# Altium schematic sheet MCU and Peripherals.SchDoc
size 431 x 279 mm; SheetNumber: 1; SheetTotal: 2
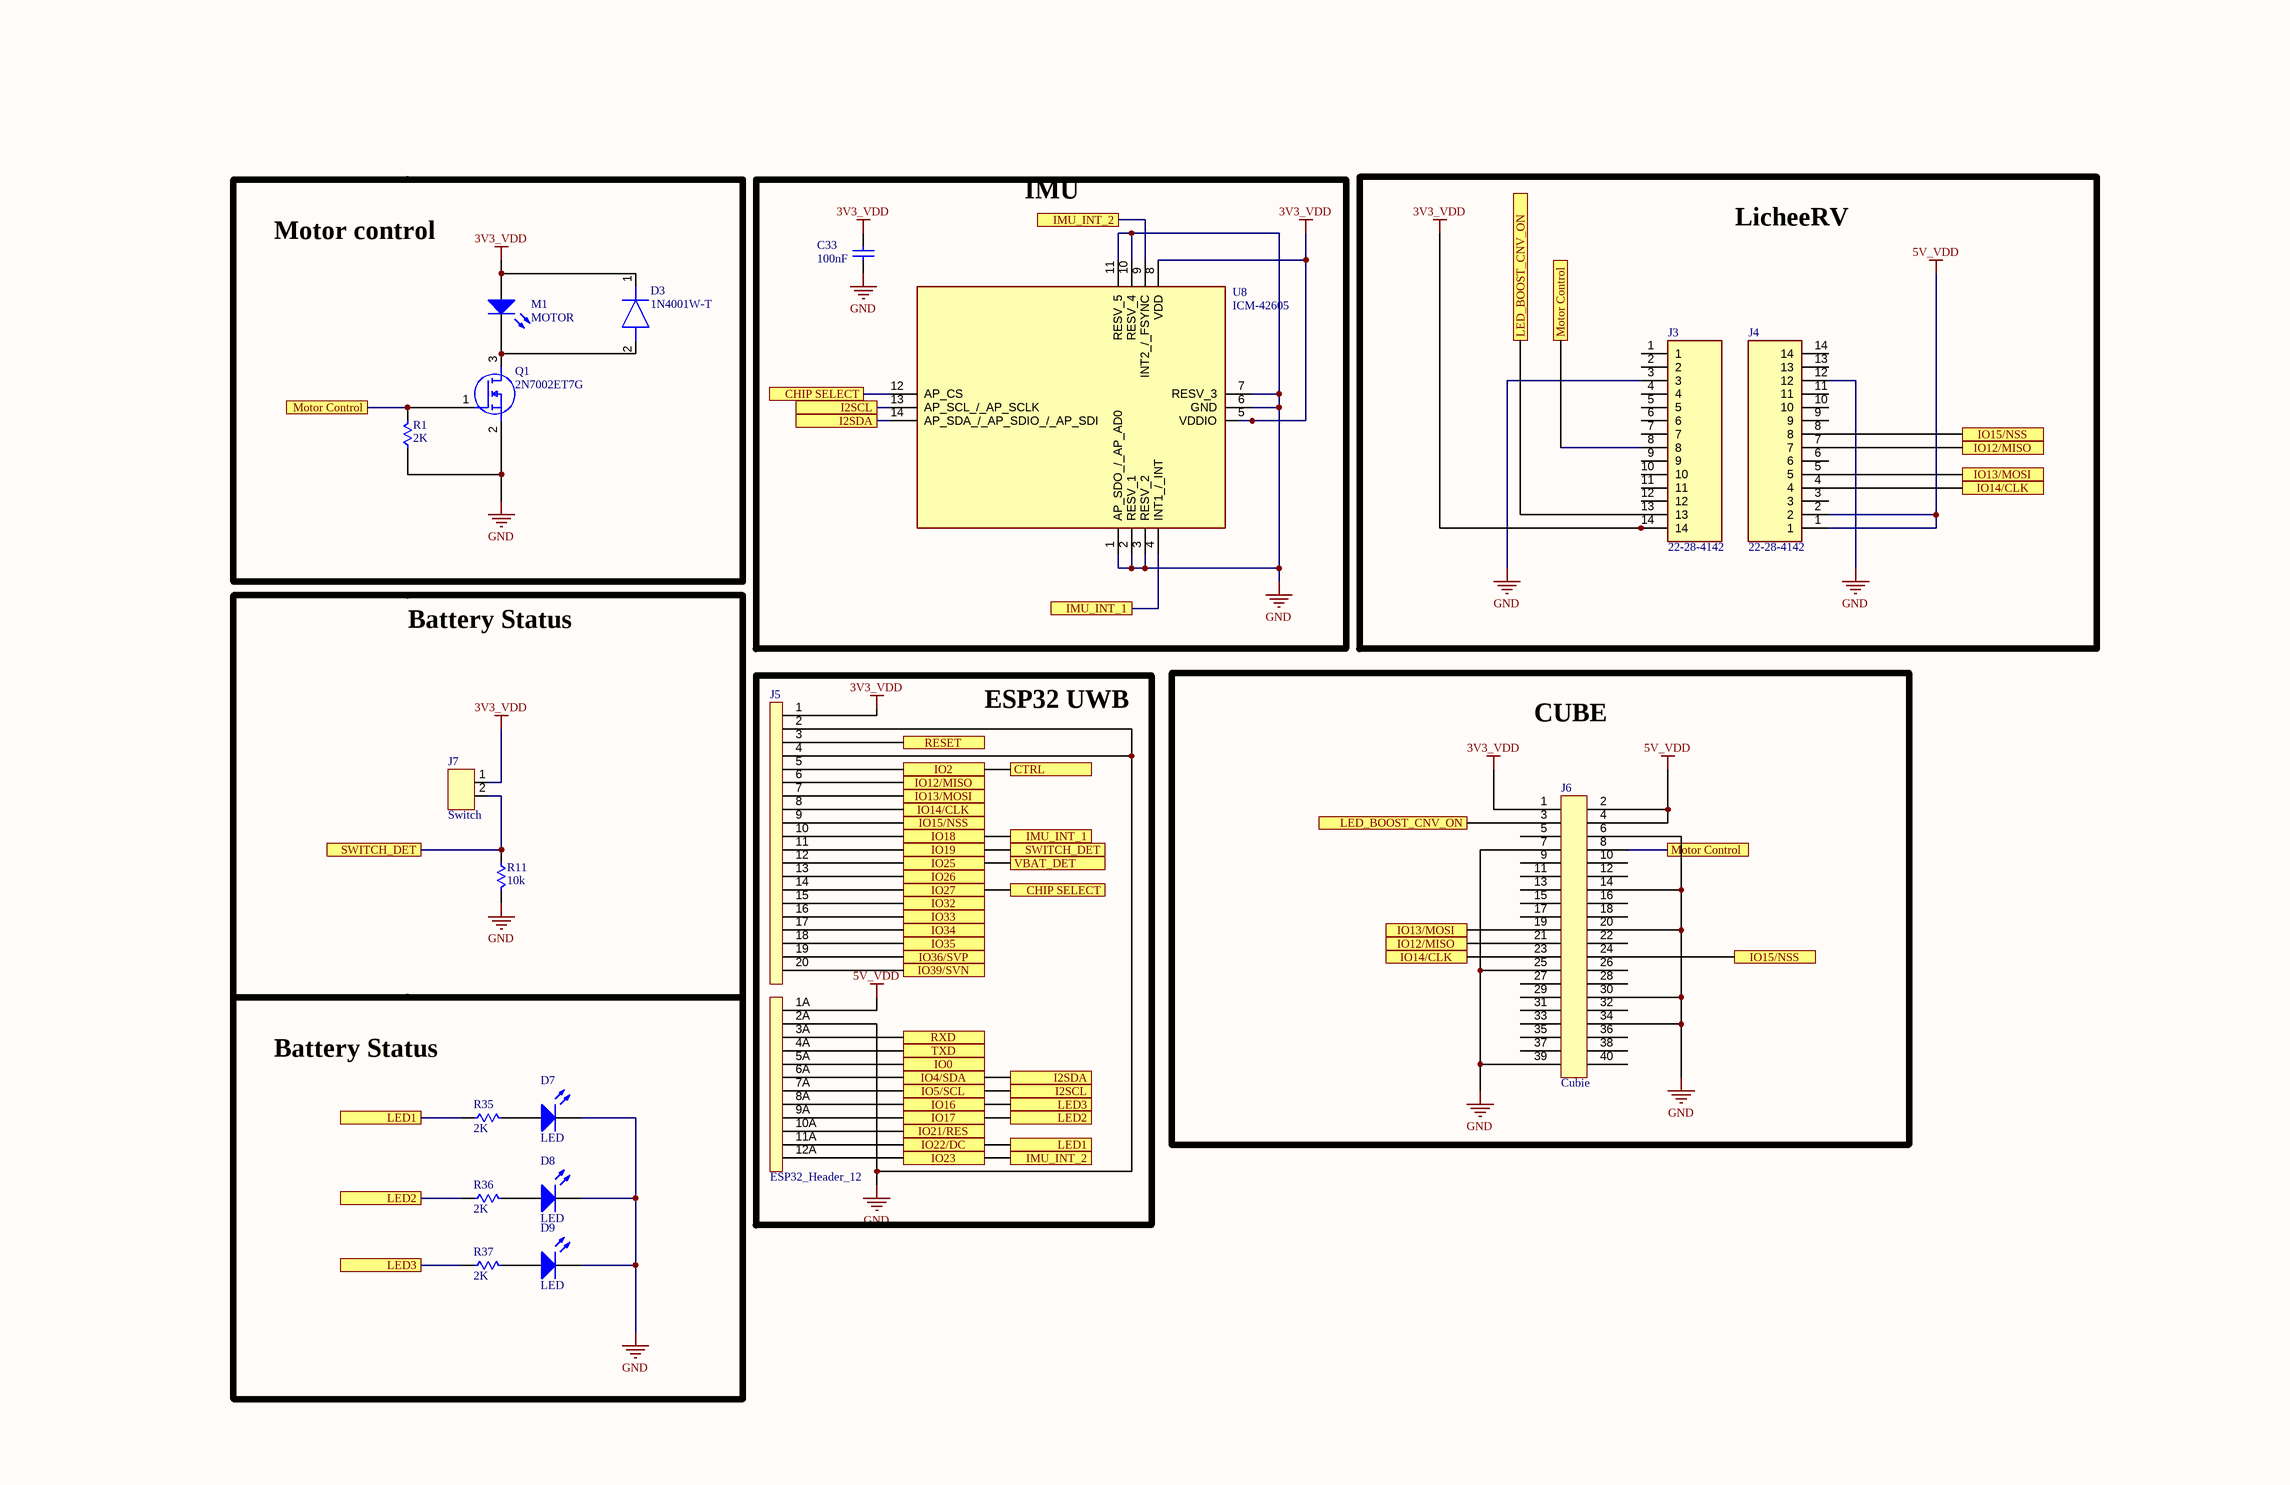
[diagram p0: MCU and Peripherals.SchDoc]

## Parts
C33  Capacitance: 100nF  [0603C]  (hidden comment: Capacitor)
D3  1N4001W-T  [SODFL3818X130N]
D7  LED  [SolderWires]
D8  LED  [SolderWires]
D9  LED  [SolderWires]
J3  22-28-4142  [HDRV14W63P0X254_1X14_3556X250X950P]
J4  22-28-4142  [HDRV14W63P0X254_1X14_3556X250X950P]
J5  ESP32_Header_12  [12P-2.54]
J6  Cubie  [40Pin]
J7  Switch  [SWITCH SOLDER]
M1  MOTOR  [SolderWires]
Q1  2N7002ET7G  [SOT96P237X111-3N]
R1  2K  [R0603]
R11  10k  [R0603]
R35  2K  [R0603]
R36  2K  [R0603]
R37  2K  [R0603]
U8  ICM-42605  [IIM42352]

## Blocks framed on the sheet
Motor control: D3 M1 Q1 R1
IMU: C33 U8
LicheeRV: J3 J4
Battery Status: J7 R11
ESP32 UWB: J5
CUBE: J6
Battery Status: D7-D9 R35-R37

## Ports
CHIP SELECT, CTRL, I2SCL, I2SDA, IMU_INT_1, IMU_INT_2, IO0, IO2, IO4/SDA, IO5/SCL, IO12/MISO, IO13/MOSI, IO14/CLK, IO15/NSS, IO16, IO17, IO18, IO19, IO21/RES, IO22/DC, IO23, IO25, IO26, IO27, IO32, IO33, IO34, IO35, IO36/SVP, IO39/SVN, LED1, LED2, LED3, LED_BOOST_CNV_ON, Motor Control, RESET, RXD, SWITCH_DET, TXD, VBAT_DET

## Nets
3V3_VDD: C33.2 D3.1(K) J3.14 J5.1 J6.1 J7.1 M1.1(A) U8.5(VDDIO) U8.8(VDD)
5V_VDD: J4.1 J4.2 J5.1A J6.2 J6.4
GND: C33.1 D7.2(K) D8.2(K) D9.2(K) J3.3 J4.12 J5.2 J5.2A J5.4 J6.6 J6.7 J6.14 J6.20 J6.25 J6.30 J6.34 J6.39 Q1.2(S) R1.1 R11.2 U8.1(AP_SDO_/_AP_AD0) U8.2(RESV_1) U8.3(RESV_2) U8.6(GND) U8.7(RESV_3) U8.10(RESV_4) U8.11(RESV_5)
CHIP SELECT: J5.14 U8.12(AP_CS) ; port CHIP SELECT, port IO27
CTRL: J5.5 ; port IO2, port CTRL
I2SCL: J5.7A U8.13(AP_SCL_/_AP_SCLK) ; port I2SCL, port IO5/SCL
I2SDA: J5.6A U8.14(AP_SDA_/_AP_SDIO_/_AP_SDI) ; port I2SDA, port IO4/SDA
IMU_INT_1: J5.10 U8.4(INT1_/_INT) ; port IMU_INT_1, port IO18
IMU_INT_2: J5.12A U8.9(INT2_/_FSYNC) ; port IMU_INT_2, port IO23
IO0: J5.5A ; port IO0
IO12/MISO: J4.7 J5.6 J6.21 ; port IO12/MISO
IO13/MOSI: J4.5 J5.7 J6.19 ; port IO13/MOSI
IO14/CLK: J4.4 J5.8 J6.23 ; port IO14/CLK
IO15/NSS: J4.8 J5.9 J6.24 ; port IO15/NSS
IO16: J5.8A R37.1 ; port LED3, port IO16
IO17: J5.9A R36.1 ; port LED2, port IO17
IO19: J5.11 J7.2 R11.1 ; port SWITCH_DET, port IO19
IO21/RES: J5.10A ; port IO21/RES
IO22/DC: J5.11A R35.1 ; port LED1, port IO22/DC
IO25: J5.12 ; port IO25, port VBAT_DET
IO26: J5.13 ; port IO26
IO32: J5.15 ; port IO32
IO33: J5.16 ; port IO33
IO34: J5.17 ; port IO34
IO35: J5.18 ; port IO35
IO36/SVP: J5.19 ; port IO36/SVP
IO39/SVN: J5.20 ; port IO39/SVN
LED_BOOST_CNV_ON: J3.13 J6.3 ; port LED_BOOST_CNV_ON
Motor Control: J3.8 J6.8 Q1.1(G) R1.2 ; port Motor Control
RESET: J5.3 ; port RESET
RXD: J5.3A ; port RXD
TXD: J5.4A ; port TXD
NetD3_2: D3.2(A) M1.2(K) Q1.3(D)
NetD7_1: D7.1(A) R35.2
NetD8_1: D8.1(A) R36.2
NetD9_1: D9.1(A) R37.2

Not connected (* = marked no-connect by the designer): J3 1 2 4 5 6 7 9 10 11 12; J4 3 6 9 10 11 13 14; J6 5(13) 9(17) 10(18) 11(19) 12(20) 13(21) 15(23) 16(24) 17 18 22 26 27 28 29 31 32 33 35 36 37 38 40

## Library data of the parts
C33 = 1: Cap Ceramic 0.1uF 50VDC X7R 10% SMD 0603 Paper T/R; Manufacturer: Samsung; Manufacturer Part Number: CL10B104KB8NNNC; Voltage Rating: 50V; ComponentLink1URL: http://www.kemet.com/docfinder?Partnumber=C0603C104K5RACTU; ComponentLink1Description: http://www.kemet.com/docfinder?Partnumber=C0603C104K5RACTU; ComponentLink2URL: https://datasheet.ciiva.com/25803/cl10b104kb8nnnc-25803393.pdf?src-supplier=Digi-Key; ComponentLink2Description: https://datasheet.ciiva.com/25803/cl10b104kb8nnnc-25803393.pdf?src-supplier=Digi-Key; ComponentLink3URL: https://datasheet.ciiva.com/26838/getdatasheetpartid-89097-26838411.pdf?src-supplier=Verical; ComponentLink3Description: https://datasheet.ciiva.com/26838/getdatasheetpartid-89097-26838411.pdf?src-supplier=Verical; ComponentLink4URL: https://datasheet.ciiva.com/29198/456651-da-01-en-vs-kondensator-0605-29198839.pdf?src-supplier=Conrad; ComponentLink4Description: https://datasheet.ciiva.com/29198/456651-da-01-en-vs-kondensator-0605-29198839.pdf?src-supplier=Conrad; Supplier 1: Digi-Key; Supplier Part Number 1: 1276-1000-1-ND; RoHS: Yes; Category: Ceramic Capacitors; Stock 1: 17279119; Pricing 1: 1=0,10000, 10=0,03200, 50=0,01720, 100=0,01410, 500=0,01008, 1000=0,00793 (USD); Mount: Surface Mount; Case/Package: 0603; Case Code (Metric): 1608; Case Code (Imperial): 0603; Material: Ceramic; Contact Plating: Tin; Min Operating Temperature: -55°C; Max Operating Temperature: 125°C; Tolerance: 10%; Package Quantity: 1; Packaging: Tape and Reel; Dielectric: X7R; Voltage: 50V; Voltage Rating (DC): 50V; Length: 1.6mm; Height: 0.8mm; Width: 0.031inch; Depth: 0.8mm; Thickness: 0.035inch; Radiation Hardening: No; Lead Free: Lead Free
D3 = 1N4001W-T: Diode; Manufacturer_Name: Rectron; Datasheet Link: https://gr.mouser.com/datasheet/2/345/1n4001w_1n4007w-2449105.pdf; Height: 1.3mm; Manufacturer_Part_Number: 1N4001W-T; Mouser Part Number: 583-1N4001W-T; Mouser Price/Stock: https://www.mouser.co.uk/ProductDetail/Rectron/1N4001W-T?qs=QNEnbhJQKvbnHIVMak28nQ%3D%3D
D7-D9 = LED3
J3 J4 = 1-826629-4: Connector; Manufacturer Part Number: 22-28-4142
M1 = LED3: LED
Q1 = 2N7002ET7G: MOSFET (N-Channel); Manufacturer_Name: onsemi; Datasheet Link: https://www.onsemi.com/pub/Collateral/2N7002E-D.PDF; Height: 1.11mm; Manufacturer_Part_Number: 2N7002ET7G; Mouser Part Number: 863-2N7002ET7G; Mouser Price/Stock: https://www.mouser.co.uk/ProductDetail/onsemi/2N7002ET7G?qs=l7cgNqFNU1iSXTOSQi2ecw%3D%3D; Arrow Part Number: 2N7002ET7G; Arrow Price/Stock: https://www.arrow.com/en/products/2n7002et7g/on-semiconductor?utm_currency=USD&region=nac
R1 R35-R37 = RC0603FR-072KL: RES SMD 2K OHM 1% 1/10W 0603; Manufacturer: Yageo; Temperature Coefficient: ±100ppm/°C; Power (Watts): 0.1W, 1/10W; Supplier 1: Digi-Key; Manufacturer Part Number: RC0603FR-072KL; RoHS: RoHS Compliant; Category: Resistors; Stock 1: 3425058; Pricing 1: 1=0.1, 10=0.015, 100=0.006, 1000=0.00268, 2500=0.00233 (USD); Tolerance: ±1%; Packaging: Cut Tape (CT); Features: Moisture Resistant; ComponentLink1URL: http://www.yageo.com/documents/recent/PYu-RC_Group_51_RoHS_L_8.pdf; ComponentLink1Description: http://www.yageo.com/documents/recent/PYu-RC_Group_51_RoHS_L_8.pdf; Supplier Part Number 1: 311-2.00KHRCT-ND; Part Status: Active; Composition: Thick Film; Operating Temperature: -55°C ~ 155°C; Package / Case: 0603 (1608 Metric); Supplier Device Package: 0603; Size / Dimension: 0.063" L x 0.032" W (1.60mm x 0.80mm); Height - Seated (Max): 0.022" (0.55mm); Failure Rate: -; Mouser Part Number: 603-RC0603FR-072KL; Arrow Part Number: RC0603FR-072KL
R11 = RC0603FR-072KL: Manufacturer Part Number: RK73H1JTTD1002F; Tolerance: ±1%; Temperature Coefficient: ±100ppm/°C; Power (Watts): 0.1W, 1/10W; Supplier 1: Digi-Key; Category: Resistors; Stock 1: 3425058; Pricing 1: 1=0.1, 10=0.015, 100=0.006, 1000=0.00268, 2500=0.00233 (USD); Packaging: Cut Tape (CT); Features: Moisture Resistant; ComponentLink1URL: http://www.yageo.com/documents/recent/PYu-RC_Group_51_RoHS_L_8.pdf; ComponentLink1Description: http://www.yageo.com/documents/recent/PYu-RC_Group_51_RoHS_L_8.pdf; Supplier Part Number 1: 311-2.00KHRCT-ND; Part Status: Active; Composition: Thick Film; Operating Temperature: -55°C ~ 155°C; Package / Case: 0603 (1608 Metric); Supplier Device Package: 0603; Size / Dimension: 0.063" L x 0.032" W (1.60mm x 0.80mm); Height - Seated (Max): 0.022" (0.55mm); Failure Rate: -; Mouser Part Number: 603-RC0603FR-072KL; Arrow Part Number: RC0603FR-072KL
U8 = ICM-42605: Accelerometer; Manufacturer_Name: TDK; Datasheet Link: https://3cfeqx1hf82y3xcoull08ihx-wpengine.netdna-ssl.com/wp-content/uploads/2020/09/DS-000292-ICM-42605-v1.5.pdf; Manufacturer Part Number: ICM-42605; Mouser Part Number: 410-ICM-42605; Mouser Price/Stock: https://www.mouser.co.uk/ProductDetail/TDK-InvenSense/ICM-42605?qs=gZXFycFWdAO0MPgeewGYjQ%3D%3D; Arrow Part Number: ICM-42605; Arrow Price/Stock: https://www.arrow.com/en/products/icm-42605/invensense?utm_currency=USD&region=nac